# Altium schematic sheet relay.SchDoc
size Letter; DocumentNumber: 5; SheetNumber: 5; SheetTotal: 6
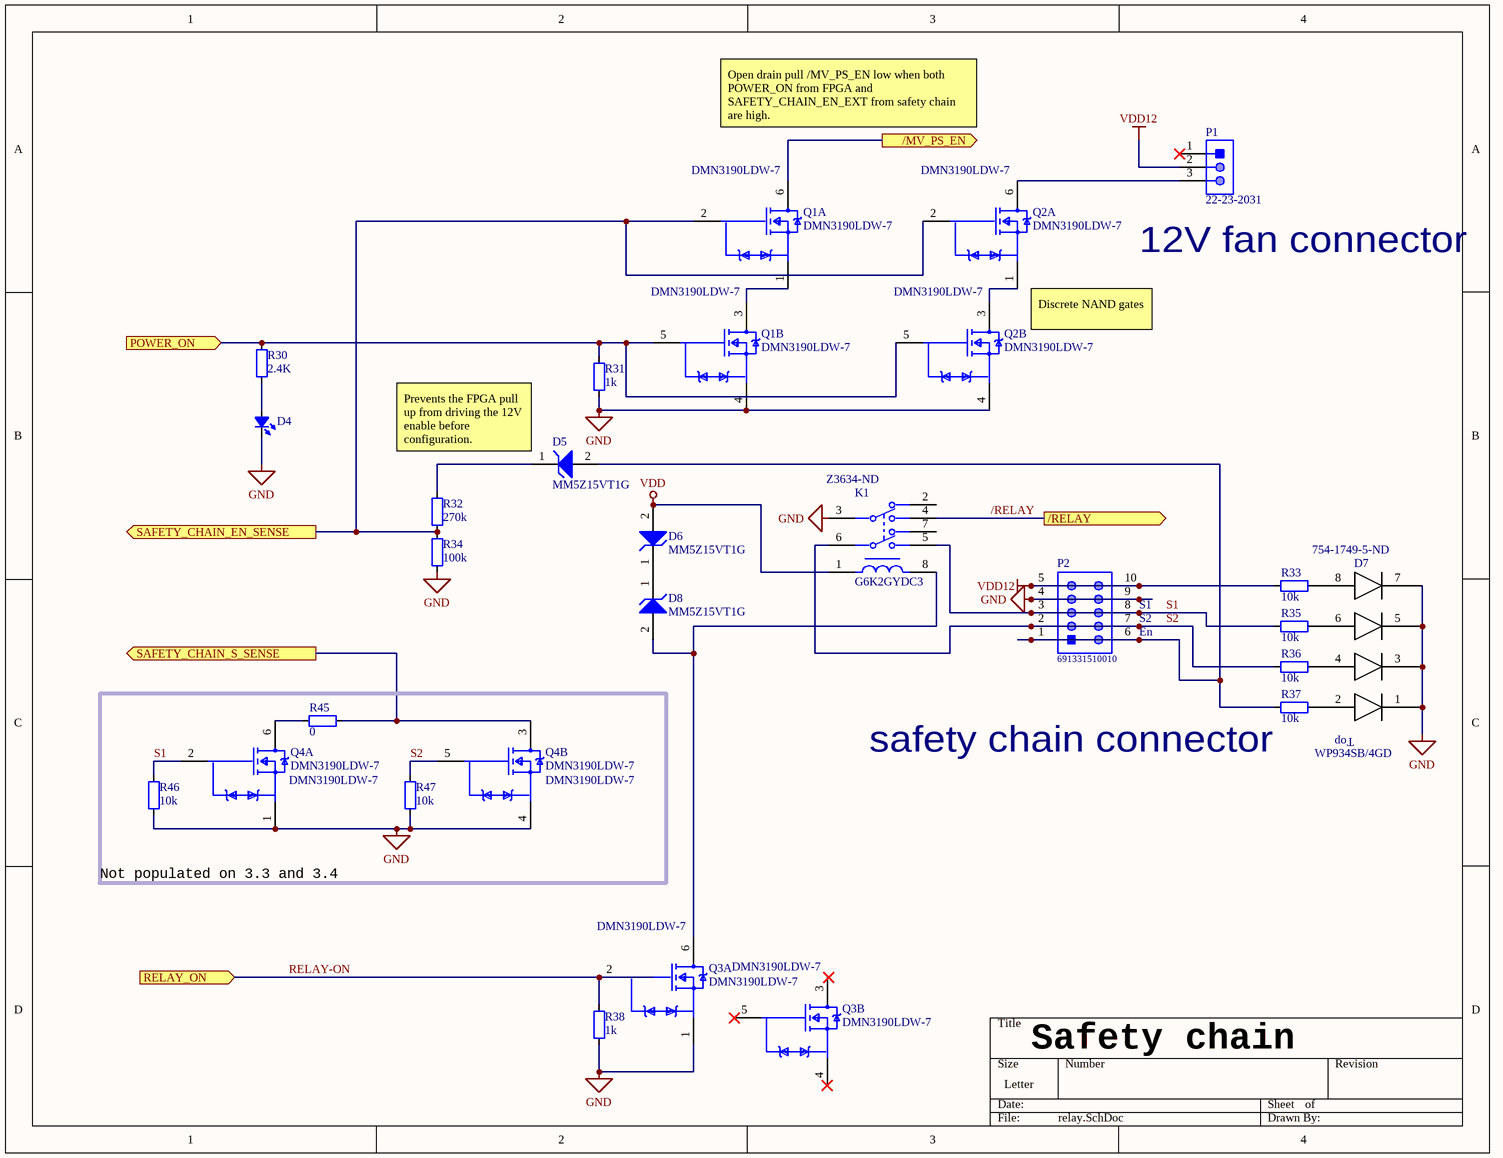
[diagram p0: relay.SchDoc]

## Parts
D4  LED_0402  [ROHM-SML-P11MT_V]  (value not drawn)
D5  MM5Z15VT1G  [ONSC-SOD-523-2-502-01_V]
D6  MM5Z15VT1G  [ONSC-SOD-523-2-502-01_V]
D7  WP934SB/4GD  Supplier Part Number 1: 754-1749-5-ND  [WP934SB/4GD]
D8  MM5Z15VT1G  [ONSC-SOD-523-2-502-01_V]
K1  G6K2GYDC3  Supplier Part Number 1: Z3634-ND  [FP-G6K2GYDC3-MFG]
P1  22-23-2031  [MOLX-22-23-2031_V]
P2  691331510010  [691331510010]
Q1  DMN3190LDW-7  [FP-SOT363-IPC_A]  (parts A,B of 2)
Q2  DMN3190LDW-7  [FP-SOT363-IPC_A]  (parts A,B of 2)
Q3  DMN3190LDW-7  [FP-SOT363-IPC_A]  (parts A,B of 2)
Q4  DMN3190LDW-7  [FP-SOT363-IPC_A]  (parts A,B of 2)
R30  value 2.4K  [FP-CRCW0402-e3-IPC_B]  (hidden comment: Res_0402)
R31  value 1k  [FP-CRCW0805-HPe3-IPC_B]  (hidden comment: Res_0805)
R32  value 270k  [FP-CRCW0402-e3-IPC_B]  (hidden comment: Res_0402)
R33  value 10k  [FP-CRCW0402-e3-IPC_B]  (hidden comment: Res_0402)
R34  value 100k  [FP-CRCW0402-e3-IPC_B]  (hidden comment: Res_0402)
R35  value 10k  [FP-CRCW0402-e3-IPC_B]  (hidden comment: Res_0402)
R36  value 10k  [FP-CRCW0402-e3-IPC_B]  (hidden comment: Res_0402)
R37  value 10k  [FP-CRCW0402-e3-IPC_B]  (hidden comment: Res_0402)
R38  value 1k  [FP-CRCW0805-HPe3-IPC_B]  (hidden comment: Res_0805)
R45  value 0  [FP-CRCW0402-e3-IPC_B]  (hidden comment: Res_0402)
R46  value 10k  [FP-CRCW0402-e3-IPC_B]  (hidden comment: Res_0402)
R47  value 10k  [FP-CRCW0402-e3-IPC_B]  (hidden comment: Res_0402)

## Blocks framed on the sheet
Not populated on 3.3 and 3.4: Q4 R45-R47

## Ports
/MV_PS_EN (out), /RELAY (out), POWER_ON (in), RELAY_ON (in), SAFETY_CHAIN_EN_SENSE (out), SAFETY_CHAIN_S_SENSE (out)

## Nets
GND: D4.2(K) D7.1 D7.3 D7.5 D7.7 K1.3 P2.4 P2.9 Q1.4(S2) Q2.4(S2) Q3.1(S1) Q4.1(S1) Q4.4(S2) R31.1 R34.1 R38.1 R46.1 R47.1
VDD: D6.2(A) K1.1
VDD12: P1.2 P2.5 P2.10 R33.2
/MV_PS_EN: Q1.6(D1) ; port /MV_PS_EN
/RELAY: K1.4 ; port /RELAY
POWER_ON: Q1.5(G2) Q2.5(G2) R30.2 R31.2 ; port POWER_ON
RELAY-ON: Q3.2(G1) R38.2 ; port RELAY_ON
S1: K1.5 P2.3 P2.8 Q4.2(G1) R35.2 R46.2
S2: K1.6 P2.2 P2.7 Q4.5(G2) R36.2 R47.2
SAFETY_CHAIN_EN_SENSE: Q1.2(G1) Q2.2(G1) R32.1 R34.2 ; port SAFETY_CHAIN_EN_SENSE
SAFETY_CHAIN_S_SENSE: Q4.3(D2) R45.2 ; port SAFETY_CHAIN_S_SENSE
NetD4_1: D4.1(A) R30.1
NetD5_1: D5.1(K) R32.2
NetD5_2: D5.2(A) P2.1 P2.6 R37.2
NetD6_1: D6.1(K) D8.1(K)
NetD7_2: D7.2 R37.1
NetD7_4: D7.4 R36.1
NetD7_6: D7.6 R35.1
NetD7_8: D7.8 R33.1
NetD8_2: D8.2(A) K1.8 Q3.6(D1)
NetP1_3: P1.3 Q2.6(D1)
NetQ1_1: Q1.1(S1) Q1.3(D2)
NetQ2_1: Q2.1(S1) Q2.3(D2)
NetQ4_6: Q4.6(D1) R45.1

Not connected (* = marked no-connect by the designer): K1 2 7; P1 1*; Q3 3(D2) 4(S2)* 5(G2)*

## Notes on the sheet
- Open drain pull /MV_PS_EN low when both POWER_ON from FPGA and SAFETY_CHAIN_EN_EXT from safety chain are high.
- (near P1) 12V fan connector
- (near Q2) Discrete NAND gates
- Prevents the FPGA pull up from driving the 12V enable before configuration.
- (near P2) S1
- (near P2) S2
- (near P2) En
- (near R37) safety chain connector
- Safety chain
- (in symbol WP934SB/4GD) Top

## Library data of the parts
D4 = LED_0402: LED ORANGE CLEAR CHIP SMD; Manufacturer: Kingbright; Manufacturer Part Number: APHHS1005SECK; Viewing Angle: 120°; Lens Style: Clear,Flat; Luminous Intensity: 240mcd; Forward Voltage: 2.1V; Forward Current: 20mA; Dominant Wavelength: 601nm; Number of LEDs: 1; Supplier 1: Digi-Key; Supplier Part Number 1: 754-1103-1-ND; RoHS: Yes; Category: LEDs; Stock 1: 25673; Pricing 1: 1=0.49000, 10=0.32500, 100=0.21700, 500=0.15010, 1000=0.12508 (USD); Mount: Surface Mount; Case/Package: 0402; Number of Pins: 2; Color: Orange; Case Code (Metric): 1005; Case Code (Imperial): 0402; Lens Color: Clear; Min Operating Temperature: -40°C; Max Operating Temperature: 85°C; Package Quantity: 2000; Packaging: Tape and Reel; Illumination Color: Orange; Test Current: 20mA; Wavelength: 601nm; Series: APHHS; Length: 1mm; Width: 0.5mm; Height: 0.6mm; Lead Free: Lead Free; RoHS Compliant: Yes; ComponentLink1URL: https://datasheet.ciiva.com/2114/aphhs1005seck-2114149.pdf?src-supplier=Digi-Key; ComponentLink1Description: https://datasheet.ciiva.com/2114/aphhs1005seck-2114149.pdf?src-supplier=Digi-Key; ComponentLink2URL: https://datasheet.ciiva.com/4688/aphhs1005seck-36485-4688716.pdf?src-supplier=Mouser; ComponentLink2Description: https://datasheet.ciiva.com/4688/aphhs1005seck-36485-4688716.pdf?src-supplier=Mouser; ComponentLink3URL: https://datasheet.ciiva.com/2114/aphhs1005seck-2114150.pdf?src-supplier=Digi-Key; ComponentLink3Description: https://datasheet.ciiva.com/2114/aphhs1005seck-2114150.pdf?src-supplier=Digi-Key; ComponentLink4URL: https://datasheet.ciiva.com/16412/aphhs1005seck-16412186.pdf?src-supplier=Future+Electronics; ComponentLink4Description: https://datasheet.ciiva.com/16412/aphhs1005seck-16412186.pdf?src-supplier=Future+Electronics; ComponentLink5URL: https://datasheet.ciiva.com/2114/aphhs1005seck-2114151.pdf?src-supplier=Digi-Key; ComponentLink5Description: https://datasheet.ciiva.com/2114/aphhs1005seck-2114151.pdf?src-supplier=Digi-Key
D5 D6 D8 = CMP-1060-00793-1: Zener Voltage Regulator, 500 mW, 2-Pin SOD-523, Pb-Free, Tape and Reel; Manufacturer: On Semiconductor; VZ Typ (V): 15; P Max (W): 0.5; PackageVersion: Rev. E, 09/2010; PartNumber: MM5Z15VT1G; ComponentLink2URL: http://www.onsemi.cn/pub_link/Collateral/MM5Z2V4T1-D.PDF; ComponentLink2Description: Datasheet; ComponentLink1Description: Manufacturer URL; PackageReference: SOD-523-2-502-01; ComponentLink3URL: http://www.onsemi.com/pub_link/Collateral/502-01.PDF; PackageDescription: 2-Pin SOD, Body 1.2 x 0.8 mm; ComponentLink3Description: Package Specification; RoHS: Pb-Free; ComponentLink1URL: http://www.onsemi.com/; Mounting Technology: Surface Mount; Packing: Tape and Reel; DatasheetVersion: Rev. 10
D7 = WP934SB/4GD: Triple Green T-1 3mm 40° Green Diffused 30 mcd 2.2 V LED Indicator Through Hole; Manufacturer: Kingbright; Lens Style: Diffused,Tinted; Voltage Rating: 2.2V; Forward Current: 20mA; Wavelength: 568nm; Luminous Intensity: 25mcd; Current: 25mA; Supplier 1: Digi-Key; Manufacturer Part Number: WP934SB/4GD; RoHS: Yes; Category: LEDs; Stock 1: 28787; Pricing 1: 1=1.91000, 10=1.20600, 100=0.89230, 500=0.81992, 1000=0.68250 (USD); Mount: Through Hole; Color: Green; Package Quantity: 600; Packaging: Bulk; Viewing Angle: 40°; Forward Voltage: 2.2V; Illumination Color: Green; Series: -; Lead Free: Lead Free; RoHS Compliant: Yes; ComponentLink1URL: https://datasheet.ciiva.com/26291/wp934sb-4gd-26291283.pdf?src-supplier=Digi-Key; ComponentLink1Description: https://datasheet.ciiva.com/26291/wp934sb-4gd-26291283.pdf?src-supplier=Digi-Key; ComponentLink2URL: https://datasheet.ciiva.com/12414/wp934sb-4gd-13439-12414341.pdf?src-supplier=Mouser; ComponentLink2Description: https://datasheet.ciiva.com/12414/wp934sb-4gd-13439-12414341.pdf?src-supplier=Mouser; ComponentLink3URL: https://datasheet.ciiva.com/2137/wp934sb-4gd-2137244.pdf?src-supplier=Digi-Key; ComponentLink3Description: https://datasheet.ciiva.com/2137/wp934sb-4gd-2137244.pdf?src-supplier=Digi-Key
K1 = CMP-08823-000034-1: RELAY TELECOM DPDT 1A 3VDC; Manufacturer: Omron; Manufacturer Part Number: G6K-2G-Y-DC3; Coil Resistance: 91R; Coil Type: Non-Latching; Max Voltage Rating (DC): 60V; Coil Voltage (DC): 3V; Release Time: 3ms; Coil Current: 33mA; Power Consumption: 100mW; Max Voltage Rating (AC): 125V; Min Operating Temperature: -40°C; Packaging: Rail/Tube; Series: G6K; Contact Material: Gold; Number of Pins: 8; Termination: Gull Wing; Lead Free: Lead Free; Throw Configuration: DPDT; Max Operating Temperature: 70°C; Relay Type: Telecom; Coil Power: 100mW; Contact Current Rating: 1A; Weight: 0.7g; Mount: Surface Mount; Max Current Rating: 1A; Package Quantity: 500; Radiation Hardening: No; Operate Time: 3ms; Supplier 1: Digi-Key; RoHS: Yes; Category: Signal Relays; Stock 1: 11994; Pricing 1: 1=4.45000, 10=4.16900, 25=3.70600, 40=3.52050, 80=3.33525, 230=2.96470, 500=2.77940, 1000=2.59411 (USD); ComponentLink1URL: https://datasheet.ciiva.com/30212/81en-g6k-30212142.pdf?src-supplier=Onlinecomponents.com; ComponentLink1Description: https://datasheet.ciiva.com/30212/81en-g6k-30212142.pdf?src-supplier=Onlinecomponents.com
P1 = CMP-2000-05242-1: Male Header, Pitch 2.54 mm, 1 x 3 Position, Height 8.18 mm, Tail Length 3.56 mm, RoHS, Bulk; Current Rating: 4A; Brand: Molex; Pitch: 2.54mm; Voltage Rating: 250V; Mounting Angle: Vertical; Type: Locking; Factory Pack Quantity: 16000; Tradename: KK; Housing Material: Nylon; Contact Material: Brass; Manufacturer URL: http://www.molex.com/; Termination Style: ThroughHole; Mounting Style: ThroughHole; Number of Positions: 3Position; Contact Gender: Pin(Male); Packaging: Bulk; Series: 6373; Datasheet Version: Sep-01; Contact Plating: Tin; Product: Headers; Datasheet URL: https://datasheet.ciiva.com/19472/232274-19472863.pdf; RoHS: Details; Product Category: Headers&WireHousings; Manufacturer: Molex; Number of Rows: 1Row
P2 = CMP-1502-02269-1: Serie 3315 - 5.08mm Double Level Horizontal Male PCB Header with Flanges WR-TBL, 10 pin; Manufacturer: Wurth Elektronik; Pin Number: 10; Datasheet URL: http://katalog.we-online.de/em/datasheet/6913315100xx.pdf; Part Number: 691331510010; Gender: Male; Manufacturer URL: http://www.we-online.de; Packaging: Box; Pitch: 5.08mm; Operating Temperature: -40to105degC; Publisher: WurthElektronik; Mounting Technology: THT; Package Reference: 691331510010
Q1-Q4 = CMP-12801-000100-1: MOSFET 2N-CH 30V 1A SOT363; Turn-Off Delay Time: 30.3ns; Turn-On Delay Time: 4.5ns; Number of Channels: 2; Max Power Dissipation: 320mW; Input Capacitance: 87pF; Rds On Max: 190mR; FET Type: 2 N-Channel; Gate to Source Voltage (Vgs): 20V; Rise Time: 8.9ns; Element Configuration: Dual; Fall Time: 15.6ns; Number of Pins: 6; Width: 1.35mm; Package Quantity: 3000; Drain to Source Voltage (Vdss): 30V; Length: 2.2mm; Case/Package: SOT-363; Weight: 0.000212oz; Min Operating Temperature: -55°C; Lead Free: Lead Free; Height: 1mm; Radiation Hardening: No; Drain to Source Resistance: 190mR; Continuous Drain Current (ID): 1A; Mount: Surface Mount; Packaging: Tape and Reel; Max Operating Temperature: 150°C; Supplier 1: Arrow Electronics; Supplier Part Number 1: DMN3190LDW-7
R30 R32-R37 R45-R47 = Res_0402: Resistor
R31 R38 = Res_0805: Resistor